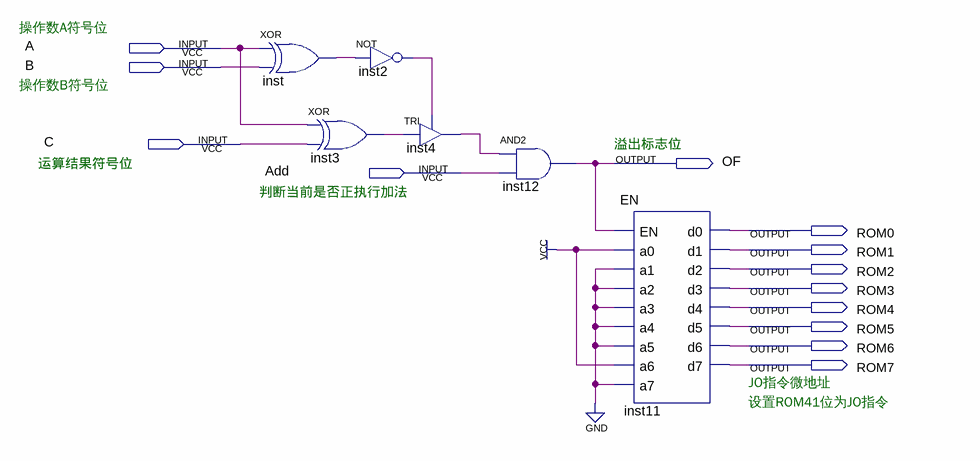
[diagram p0: schematic sheet]
// Quartus schematic JO.bdf as structural Verilog: 6 symbols, 13 pins
module JO (
  input  A,
  input  B,
  input  C,
  input  Add,
  output OF,
  output ROM0,
  output ROM1,
  output ROM2,
  output ROM3,
  output ROM4,
  output ROM5,
  output ROM6,
  output ROM7
);

  wire inst2_out, inst3_out, inst4_out, inst_out;

  xor inst (inst_out, A, B);
  xor inst3 (inst3_out, A, C);
  not inst2 (inst2_out, inst_out);
  TRI inst4 (.IN(inst3_out), .OE(inst2_out), .OUT(inst4_out));
  and inst12 (OF, inst4_out, Add);
  EN inst11 (
    .EN(OF), .a0(1'b1), .a1(1'b0), .a2(1'b0), .a3(1'b0), .a4(1'b0), .a5(1'b0), .a6(1'b1), .a7(1'b0),
    .d0(ROM0), .d1(ROM1), .d2(ROM2), .d3(ROM3), .d4(ROM4), .d5(ROM5), .d6(ROM6), .d7(ROM7));

  // Notes on the sheet:
  //   操作数A符号位
  //   操作数B符号位
  //   溢出标志位
  //   运算结果符号位
  //   判断当前是否正执行加法
  //   JO指令微地址
  //   设置ROM41位为JO指令
endmodule
